# EasyEDA schematic SCH_SAO-ctf-2024_2024-02-07.json
TITLE: CTF ADDON 2024; REV: 1.0; Date: 2024-01-19; Sheet: 1/1; Drawn By: jmarcil; Company: NorthSec
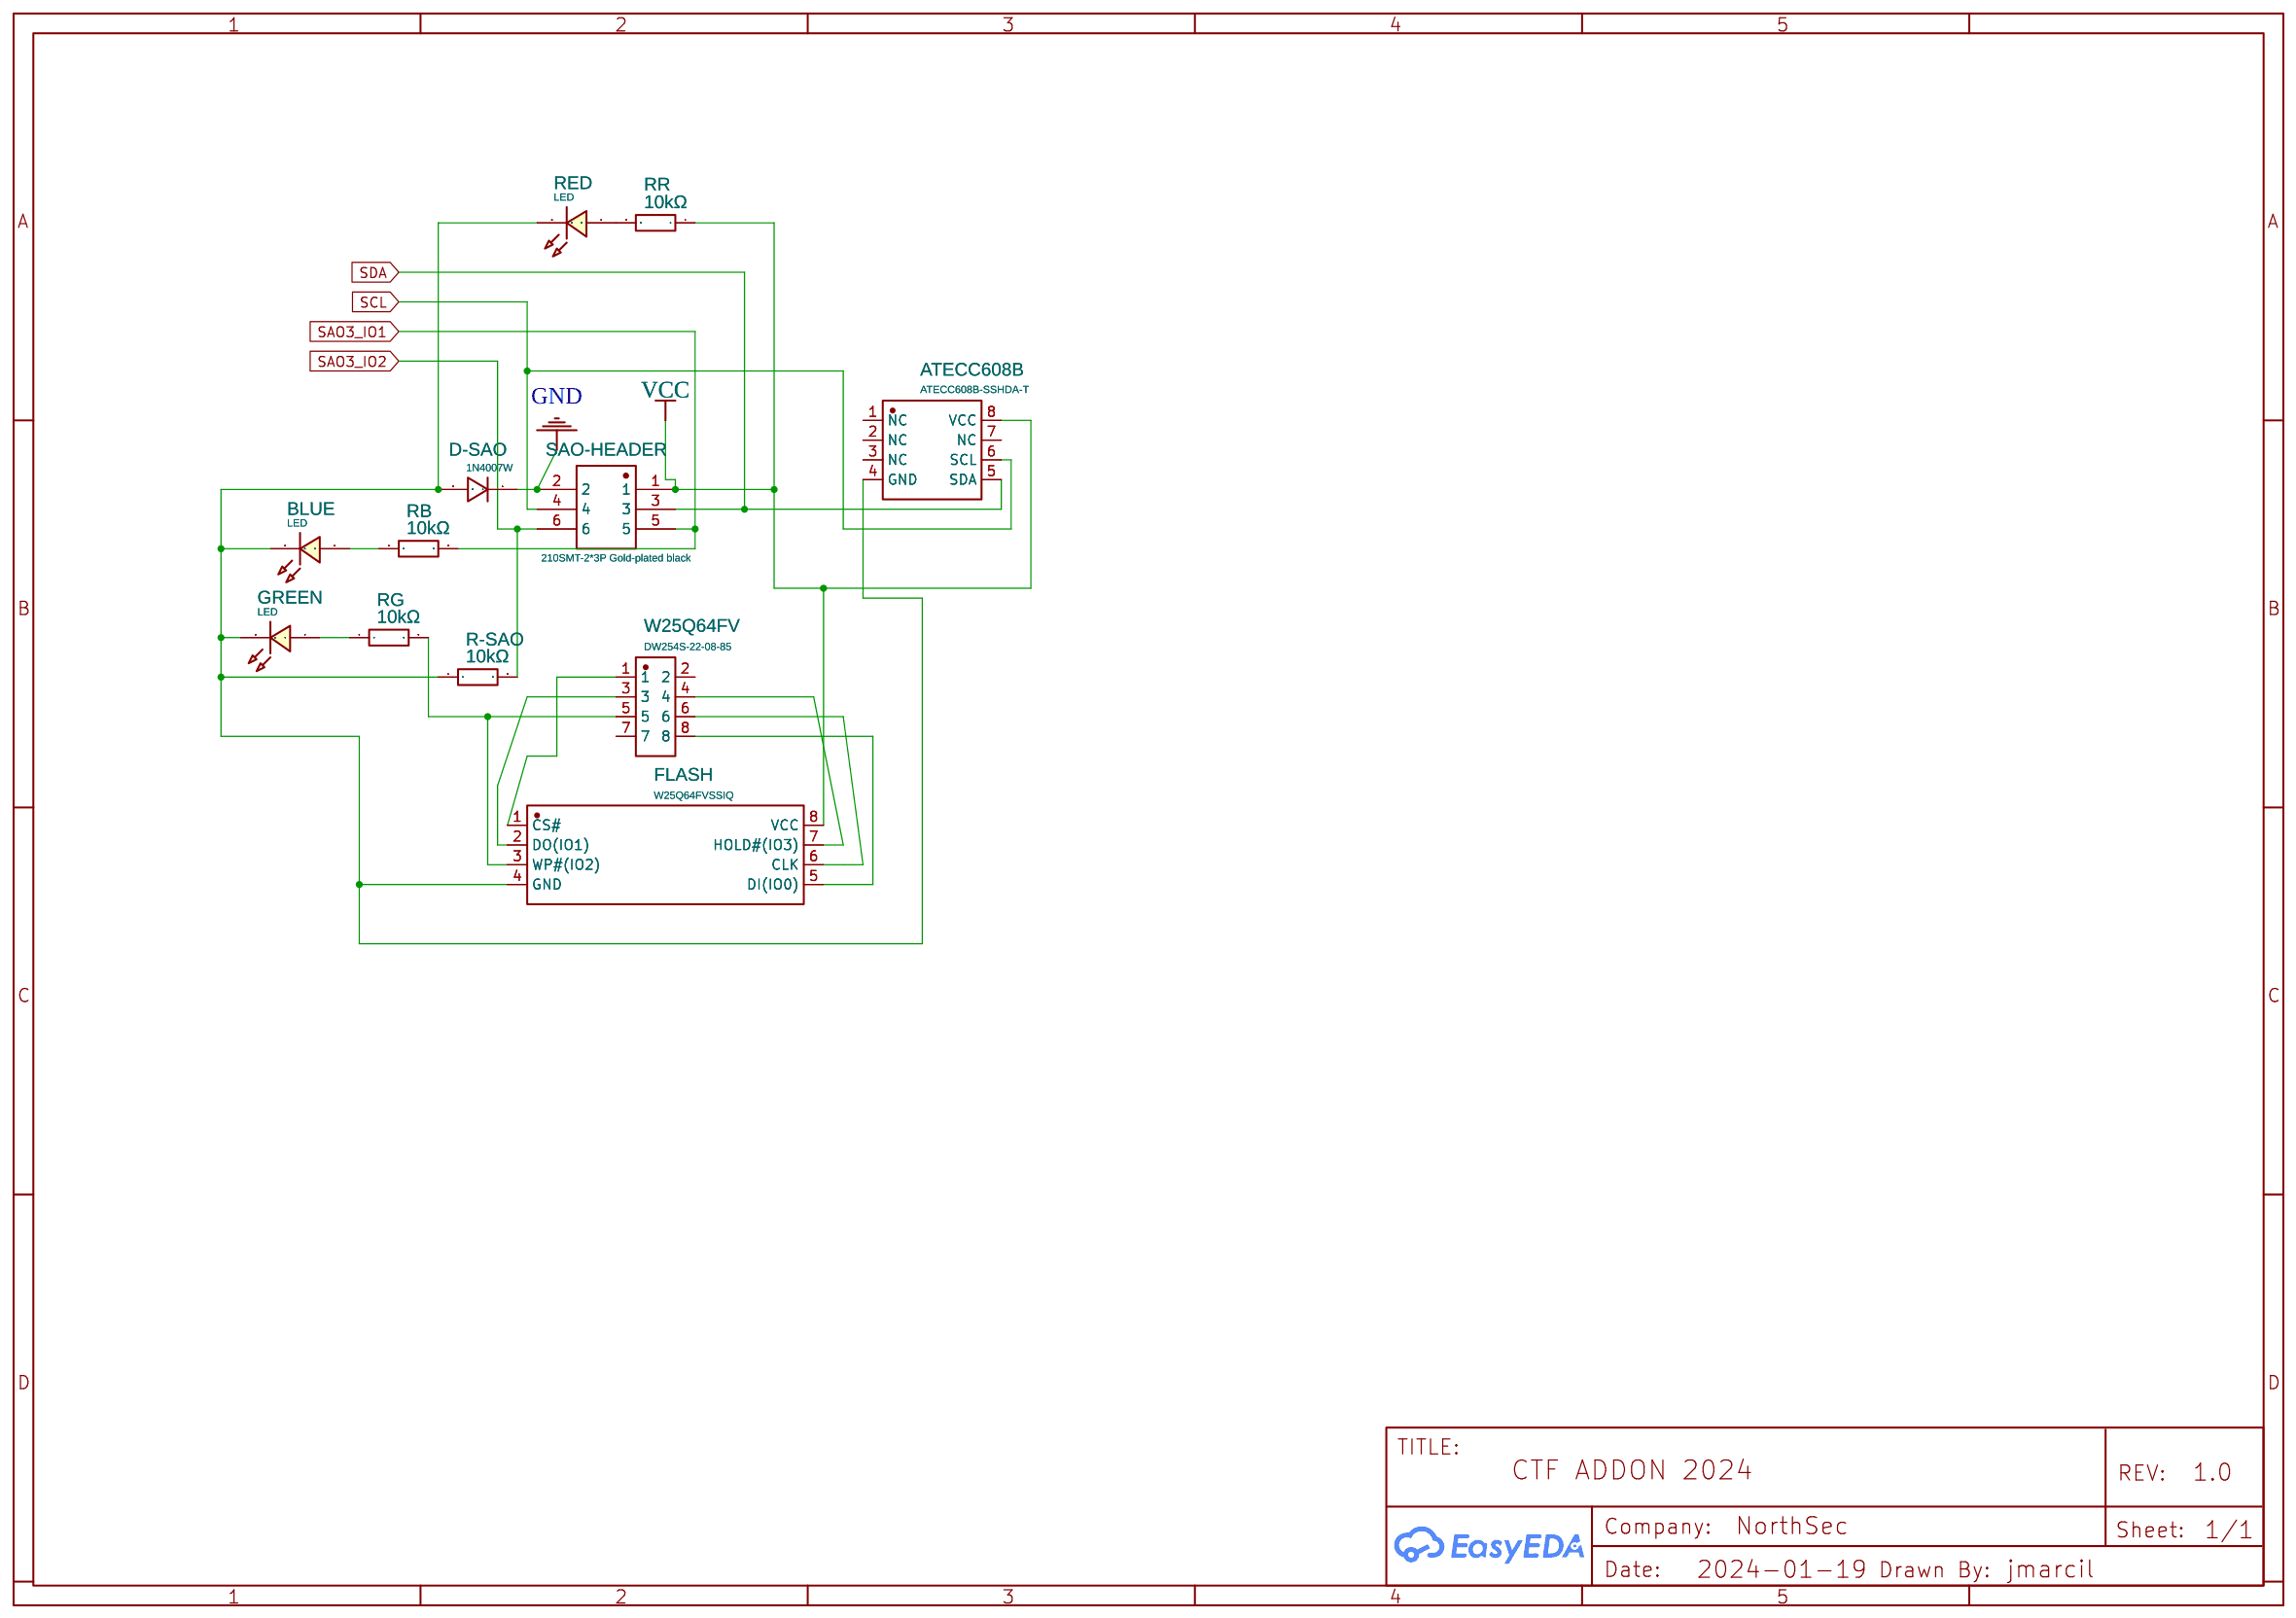
[diagram p0: schematic sheet]

## Parts
ATECC608B  ATECC608B-SSHDA-T  [SOIC-8_L4.9-W3.9-P1.27-LS6.0-BL]
BLUE  LED  [LED0603_BLUE]
D-SAO  1N4007W  [SOD-123_L2.8-W1.8-LS3.7-RD]
FLASH  W25Q64FVSSIQ  [SOIC-8_L5.3-W5.3-P1.27-LS8.0-BL]
GREEN  LED  [LED0603_GREEN]
R-SAO  10kΩ  [R1206]
RB  10kΩ  [R1206]
RED  LED  [LED0603_RED]
RG  10kΩ  [R1206]
RR  10kΩ  [R1206]
SAO-HEADER  210SMT-2*3P Gold-plated black  [HDR-SMD_6P-P2.54-V-M-R2-C3-S2.54-LS7.3]
W25Q64FV  DW254S-22-08-85  [HDR-SMD_8P-P2.54-V-F-R2-C4-S7.1]

## Library data of the parts
ATECC608B = ATECC608B-SSHDA-T: Contributor: LCSC; Supplier: LCSC; Supplier Part: C1518769; Manufacturer: MICROCHIP(美国微芯); JLCPCB Part Class: Extended Part
BLUE = LED-0603_B: Manufacturer: EVERLIGHT(台湾亿光); Manufacturer Part: 19-217/BHC-ZL1M2RY/3T; Supplier Part: C72041; Supplier: LCSC; Contributor: LCEDA_01
D-SAO = 1N4007W: Supplier: LCSC; Supplier Part: C328592; Manufacturer: BLUE ROCKET; Contributor: LCEDA_Lib
FLASH = W25Q64FVSSIQ: Contributor: LCSC; Supplier: LCSC; Supplier Part: C2943203; Manufacturer: WINBOND(华邦); JLCPCB Part Class: Extended Part
GREEN = LED-0603_G: Manufacturer: EVERLIGHT(台湾亿光); Manufacturer Part: 19-217/GHC-YR1S2/3T; Supplier Part: C72043; Supplier: LCSC; Contributor: LCEDA_Lib
R-SAO RB RG RR = 1206W4F1002T5E: Supplier: LCSC; Manufacturer: UNI-ROYAL(厚声); Supplier Part: C17902; JLCPCB Part Class: Basic Part
RED = LED-0603_R: Manufacturer: EVERLIGHT(台湾亿光); Manufacturer Part: 19-217/R6C-AL1M2VY/3T; Supplier Part: C72044; Supplier: LCSC; Contributor: LCEDA_01
SAO-HEADER = 210SMT-2*3P Gold-plated black: Contributor: LCSC; Supplier: LCSC; Manufacturer: Ckmtw(灿科盟); Manufacturer Part: B-2100N06P-B111; Supplier Part: C124390; JLCPCB Part Class: Extended Part; link: https://lcsc.com/eda_search?q=C124390&%26type=1&ref=editor
W25Q64FV = DW254S-22-08-85: Supplier: LCSC; Supplier Part: C5160819; Manufacturer: DEALON(德艺隆); JLCPCB Part Class: Extended Part; Contributor: lcsc

## Nets
GND: D-SAO.1 SAO-HEADER.2
VCC: ATECC608B.8(VCC) FLASH.8(VCC) RR.1 SAO-HEADER.1
SAO3_IO1: RB.2 SAO-HEADER.5
SAO3_IO2: R-SAO.2 SAO-HEADER.6
SCL: ATECC608B.6(SCL) SAO-HEADER.4
SDA: ATECC608B.5(SDA) SAO-HEADER.3
Net-(ATECC608B-4): ATECC608B.4(GND) BLUE.2 D-SAO.2 FLASH.4(GND) GREEN.2 R-SAO.1 RED.2
Net-(BLUE-1): BLUE.1 RB.1
Net-(FLASH-1): FLASH.1(CS#) W25Q64FV.1
Net-(FLASH-2): FLASH.2(DO(IO1)) W25Q64FV.3
Net-(FLASH-3): FLASH.3(WP#(IO2)) RG.2 W25Q64FV.5
Net-(FLASH-5): FLASH.5(DI(IO0)) W25Q64FV.8
Net-(FLASH-6): FLASH.6(CLK) W25Q64FV.6
Net-(FLASH-7): FLASH.7(HOLD#(IO3)) W25Q64FV.4
Net-(GREEN-1): GREEN.1 RG.1
Net-(RED-1): RED.1 RR.2

Not connected (* = marked no-connect by the designer): ATECC608B 1(NC) 2(NC) 3(NC) 7(NC); W25Q64FV 2 7
